# EAGLE design 8RelaySwitch (EAGLE 6.4)
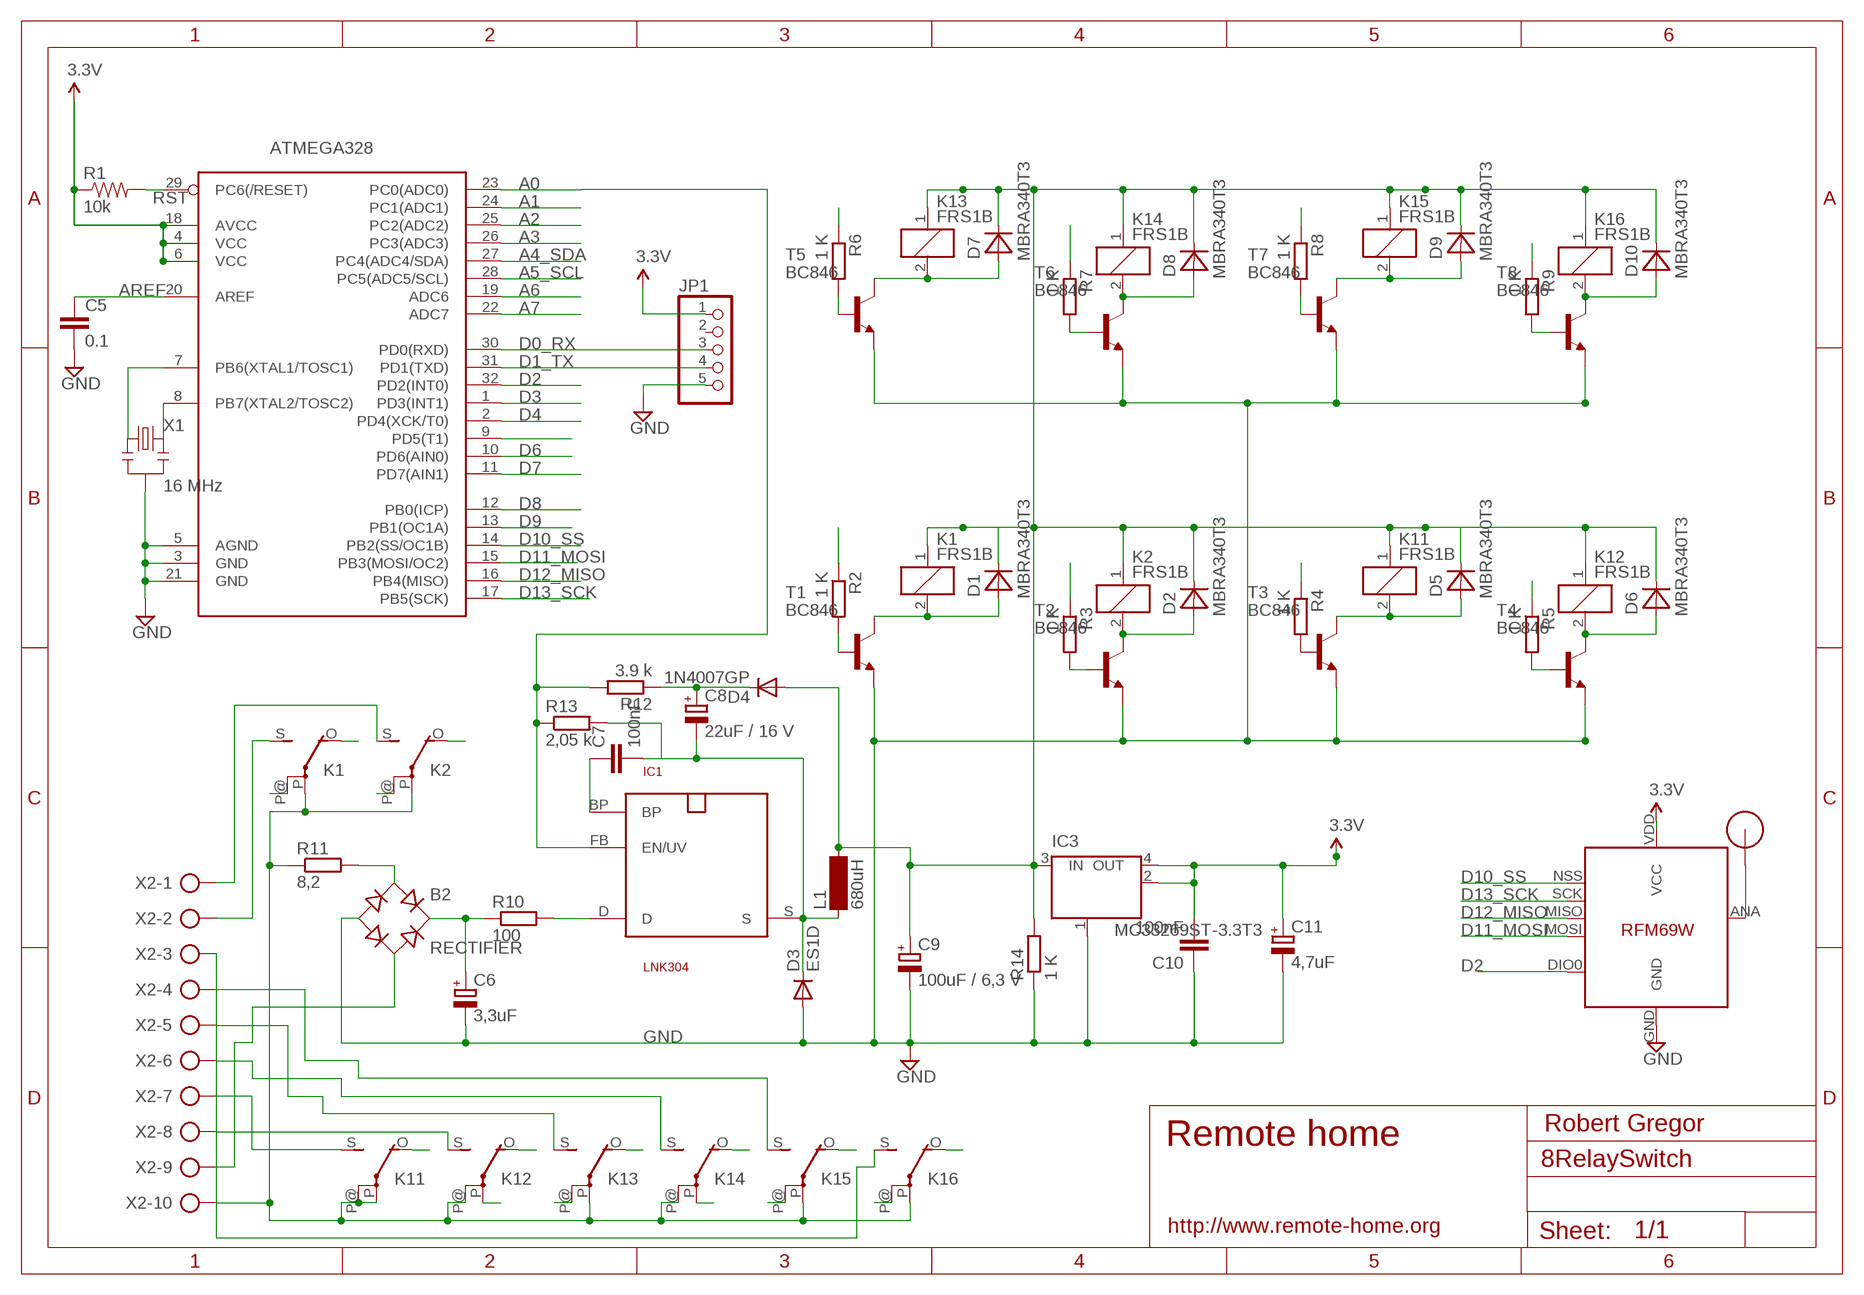
[diagram p0: schematic, sheet 1]

## Parts
ATMEGA328  ATMega-328  ATMEGA168/328TQFP32  [TQFP32-08]
B2  RECTIFIER  RECTIFIER-S40  [TO-269AA]
C5  0.1  CAP0603-CAP  [0603-CAP]
C6  3,3uF  CPOL-EUE5-10.5  [E5-10,5]
C7  100nF  C-EUC2012  [C2012]
C8  22uF / 16 V  CPOL-EUSMCC  [SMC_C]
C9  100uF / 6,3 V  CPOL-EUE2.5-5  [E2,5-5]
C10  100nF  C-EUC2012  [C2012]
C11  4,7uF  CPOL-EUSMCA  [SMC_A]
D1  MBRA340T3  [SMA]
D2  MBRA340T3  [SMA]
D3  ES1D  DIODE-DO214AC  [DO214AC]
D4  1N4007GP  DIODE-DO214AA  [DO214AA]
D5  MBRA340T3  [SMA]
D6  MBRA340T3  [SMA]
D7  MBRA340T3  [SMA]
D8  MBRA340T3  [SMA]
D9  MBRA340T3  [SMA]
D10  MBRA340T3  [SMA]
IC1  LNK304  SO-8C  [SO-8C]
IC3  MC33269ST-3.3T3  [SOT223]
JP1  PINHD-1X5  [1X05]
K1  FRS1B  [FRS1B]
K2  FRS1B  [FRS1B]
K11  FRS1B  [FRS1B]
K12  FRS1B  [FRS1B]
K13  FRS1B  [FRS1B]
K14  FRS1B  [FRS1B]
K15  FRS1B  [FRS1B]
K16  FRS1B  [FRS1B]
L1  680uH  BS11  [BS11]
R1  10k  RESISTOR0603-RES  [0603-RES]
R2  1 K  R-EU_M2012  [M2012]
R3  1 K  R-EU_M2012  [M2012]
R4  1 K  R-EU_M2012  [M2012]
R5  1 K  R-EU_M2012  [M2012]
R6  1 K  R-EU_M2012  [M2012]
R7  1 K  R-EU_M2012  [M2012]
R8  1 K  R-EU_M2012  [M2012]
R9  1 K  R-EU_M2012  [M2012]
R10  100  R-EU_R2512W  [R2512W]
R11  8,2  R-EU_0411/12  [0411/12]
R12  3.9 k  R-EU_M2012  [M2012]
R13  2,05 k  R-EU_M2012  [M2012]
R14  1 K  R-EU_M2012  [M2012]
T1  BC846  [SOT23]
T2  BC846  [SOT23]
T3  BC846  [SOT23]
T4  BC846  [SOT23]
T5  BC846  [SOT23]
T6  BC846  [SOT23]
T7  BC846  [SOT23]
T8  BC846  [SOT23]
U$1  RFM12B_ANTENNA  [RFM12B-ANTENNA]
U$5  RFM69  [RFM69W-MINPADS]
X1  16 MHz  RESONATORSMD  [RESONATOR-SMD]
X2  AK500/10  [AK500/10]

## Nets
5V1: C9.+ D1.C D2.C D4.A D5.C D6.C D7.C D8.C D9.C D10.C IC3.3(IN) K1.1 K2.1 K11.1 K12.1 K13.1 K14.1 K15.1 K16.1 L1.2 R14.2
A0: ATMEGA328.23(PC0(ADC0)) IC1.FB(EN/UV) R12.2 R13.1
A1: ATMEGA328.24(PC1(ADC1)) R6.1
A2: ATMEGA328.25(PC2(ADC2))
A3: ATMEGA328.26(PC3(ADC3))
A4_SDA: ATMEGA328.27(PC4(ADC4/SDA))
A5_SCL: ATMEGA328.28(PC5(ADC5/SCL))
A6: ATMEGA328.19(ADC6)
A7: ATMEGA328.22(ADC7)
AREF: ATMEGA328.20(AREF) C5.1
D0_RX: ATMEGA328.30(PD0(RXD)) JP1.3
D1_TX: ATMEGA328.31(PD1(TXD)) JP1.4
D2: ATMEGA328.32(PD2(INT0)) U$5.DIO0
D3: ATMEGA328.1(PD3(INT1)) R7.1
D4: ATMEGA328.2(PD4(XCK/T0)) R8.1
D5: ATMEGA328.9(PD5(T1)) R2.1
D6: ATMEGA328.10(PD6(AIN0)) R3.1
D7: ATMEGA328.11(PD7(AIN1)) R4.1
D8: ATMEGA328.12(PB0(ICP)) R5.1
D9: ATMEGA328.13(PB1(OC1A)) R9.1
D10_SS: ATMEGA328.14(PB2(SS/OC1B)) U$5.NSS(SEL)
D11_MOSI: ATMEGA328.15(PB3(MOSI/OC2)) U$5.MOSI
D12_MISO: ATMEGA328.16(PB4(MISO)) U$5.MISO
D13_SCK: ATMEGA328.17(PB5(SCK)) U$5.SCK
GND [power]: ATMEGA328.3(GND) ATMEGA328.5(AGND) ATMEGA328.21(GND) B2.- C5.2 C6.- C9.- C10.1 C11.- D3.A IC3.1(GND/ADJ) JP1.5 R14.1 T1.2(E) T2.2(E) T3.2(E) T4.2(E) T5.2(E) T6.2(E) T7.2(E) T8.2(E) U$5.GND X1.2
N$1: ATMEGA328.7(PB6(XTAL1/TOSC1)) X1.1
N$2: R2.2 T1.1(B)
N$3: U$1.P$1 U$5.ANA(ANT)
N$4: D2.A K2.2 T2.3(C)
N$5: D1.A K1.2 T1.3(C)
N$6: R3.2 T2.1(B)
N$7 [220V]: K1.S(2:S) X2.2
N$8 [220V]: K12.P(2:P)
N$9 [220V]: B2.AC2 X2.9
N$10: C7.2 C8.- D3.C IC1.S L1.1 R13.2
N$11 [220V]: K1.P@(2:P)
N$13 [220V]: IC1.D R10.2
N$14 [220V]: B2.+ C6.+ R10.1
N$15 [220V]: B2.AC1 R11.2
N$16 [220V]: K2.P@(2:P)
N$17 [220V]: K1.O(2:O)
N$18: C7.1 IC1.BP
N$19 [220V]: K2.O(2:O)
N$20: C8.+ D4.C R12.1
N$21: ATMEGA328.8(PB7(XTAL2/TOSC2)) X1.3
N$22: D5.A K11.2 T3.3(C)
N$24: R4.2 T3.1(B)
N$25: D6.A K12.2 T4.3(C)
N$26: R5.2 T4.1(B)
N$27: D7.A K13.2 T5.3(C)
N$28: R6.2 T5.1(B)
N$29: D8.A K14.2 T6.3(C)
N$30: R7.2 T6.1(B)
N$31: D9.A K15.2 T7.3(C)
N$32: R8.2 T7.1(B)
N$33: D10.A K16.2 T8.3(C)
N$34: R9.2 T8.1(B)
N$35 [220V]: K14.P(2:P)
N$36 [220V]: K12.S(2:S) X2.8
N$37 [220V]: K11.S(2:S) X2.7
N$38 [220V]: K13.P@(2:P)
N$39 [220V]: K1.P(2:P) K2.P(2:P) K11.P(2:P) K11.P@(2:P) K12.P@(2:P) K13.P(2:P) K14.P@(2:P) K15.P(2:P) K16.P(2:P) R11.1 X2.10
N$40 [220V]: K15.P@(2:P)
N$41 [220V]: K16.P@(2:P)
N$42 [220V]: K11.O(2:O)
N$43 [220V]: K12.O(2:O)
N$44 [220V]: K13.O(2:O)
N$45 [220V]: K14.O(2:O)
N$46 [220V]: K15.O(2:O)
N$47 [220V]: K16.S(2:S) X2.3
N$48 [220V]: K2.S(2:S) X2.1
N$50 [220V]: K13.S(2:S) X2.5
N$51 [220V]: K14.S(2:S) X2.6
N$52 [220V]: K15.S(2:S) X2.4
N$53 [220V]: K16.O(2:O)
RST: ATMEGA328.29(PC6(/RESET)) R1.2
VCC: ATMEGA328.4(VCC) ATMEGA328.6(VCC) ATMEGA328.18(AVCC) C10.2 C11.+ IC3.2(OUT) IC3.4(OUT) JP1.1 R1.1 U$5.VDD(VCC) ; supply symbol labelled 3.3V
Unconnected: JP1.2

## Notes on the sheet
- Robert Gregor
- Remote home
- http://www.remote-home.org

## Library data of the parts
ATMEGA328 = LowPowerLab:ATMEGA168/328: Atmel 32-pin 8-bit micro, 16k flash.
B2 = rectifier:RECTIFIER-: Rectifier
C5 = LowPowerLab:CAP: Capacitor Standard 0603 ceramic capacitor, and 0.1" leaded capacitor.
C6 C8 C9 C11 = resistor:CPOL-EU: POLARIZED CAPACITOR, European symbol
C7 C10 = resistor:C-EU: CAPACITOR, European symbol
D1 D2 D5-D10 = diode:MBRA340T3: Surface Mount Schottky Power Rectifier Source: http://www.onsemi.com/pub_link/Collateral/MBRA340T3-D.PDF
D3 D4 = diode:DIODE-: DIODE
IC1 = powerint:SO-8C: 700V MOSFET für Schaltnetz-Trafos. Pin 3 fehlt. SMD
IC3 = linear:MC33269ST*: Adjustable Output Low Dropout Voltage Regulator 800 mA Source: http://www.onsemi.com/pub/Collateral/MC33269-D.PDF
JP1 = pinhead:PINHD-1X5: PIN HEADER
K1 K2 K11-K16 = relay:FRS1B: RELAY 1 x switch, same as V23101-D6-A201, Siemens; OC_FARNELL: unknown; OC_NEWARK: unknown
L1 = inductor-neosid:BS: INDUCTOR nominal inductance, magnetically screened; OC_FARNELL: unknown; OC_NEWARK: unknown
R1 = LowPowerLab:RESISTOR: Resistor Basic schematic elements and footprints for 0603, 1206, and PTH resistors.
R2-R14 = resistor:R-EU_: RESISTOR, European symbol
T1-T8 = transistor:BC846: NPN TRANSISTOR
U$1 = LowPowerLab:RFM12B_ANTENNA
U$5 = LowPowerLab:RFM69
X1 = SparkFun:RESONATOR: Resonator Small SMD resonator. This is the itty bitty 10/20MHz resonators with built in caps. CSTCE10M0G55 and CSTCE20M0V53. Footprint has been reviewed closely but hasn't been tested yet.
X2 = con-ptr500:AK500/10: CONNECTOR; OC_FARNELL: unknown; OC_NEWARK: unknown

## Net classes
1 power: width 0.381 mm, clearance 0.254 mm
2 220V: width 0.381 mm, clearance 0.508 mm

## Board
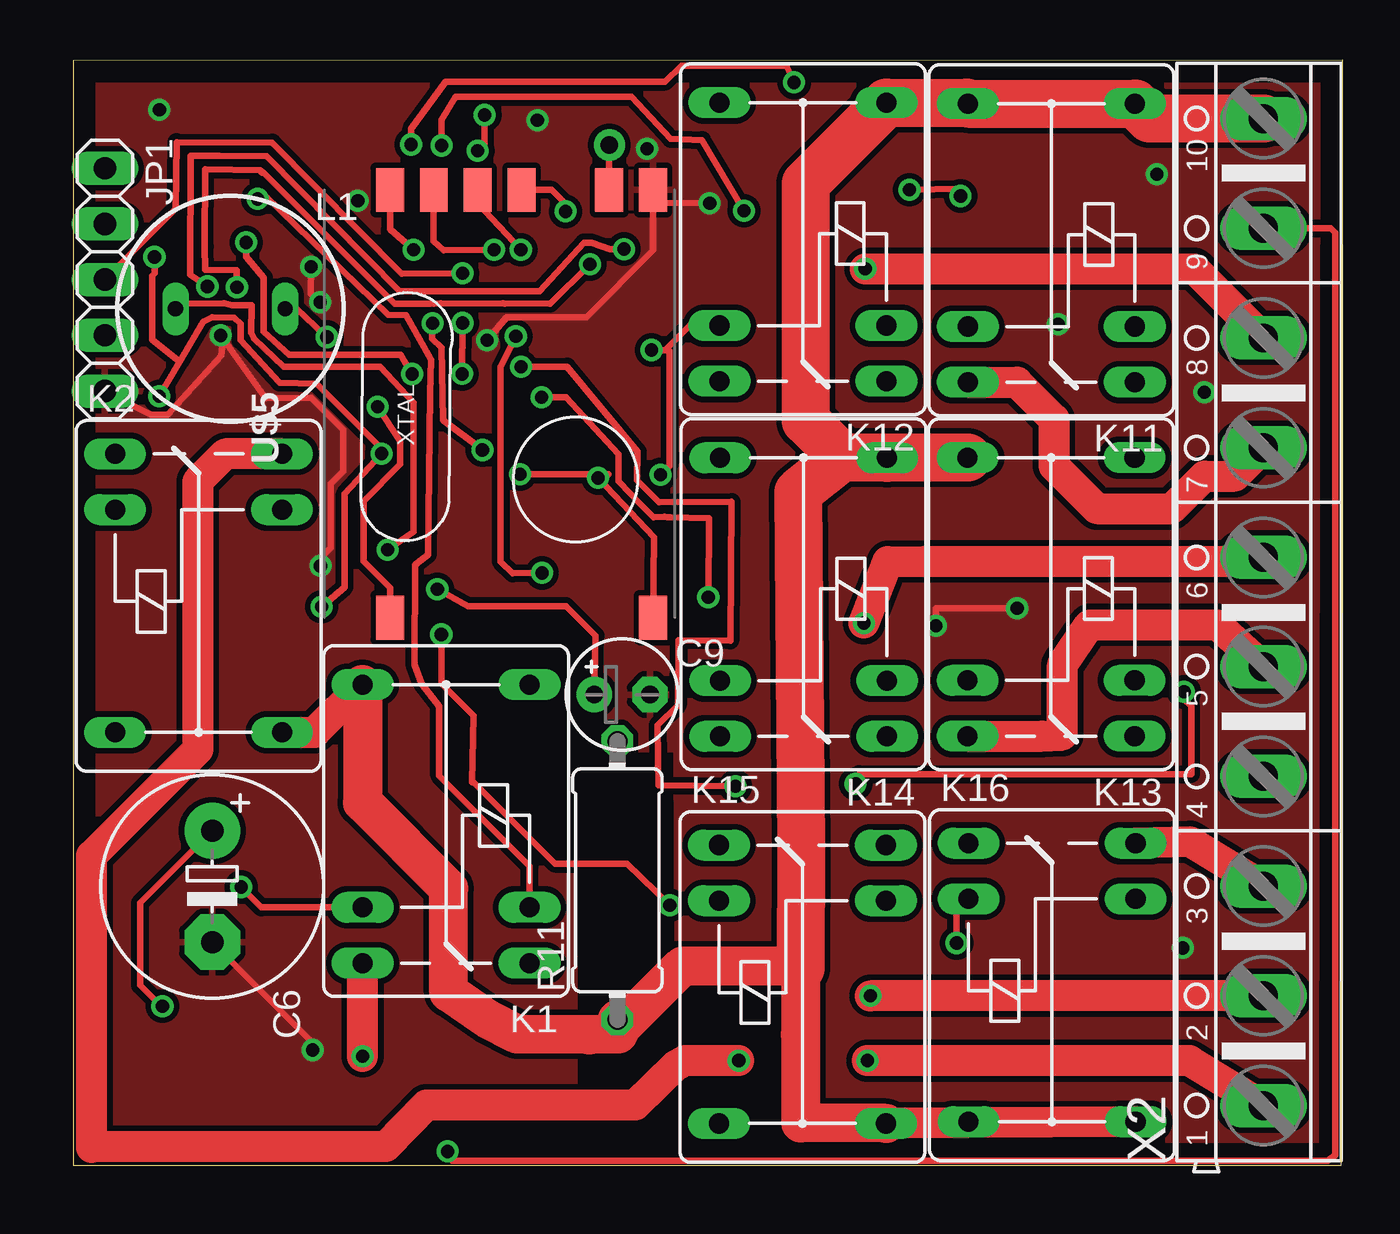
[diagram p1: board, top side]
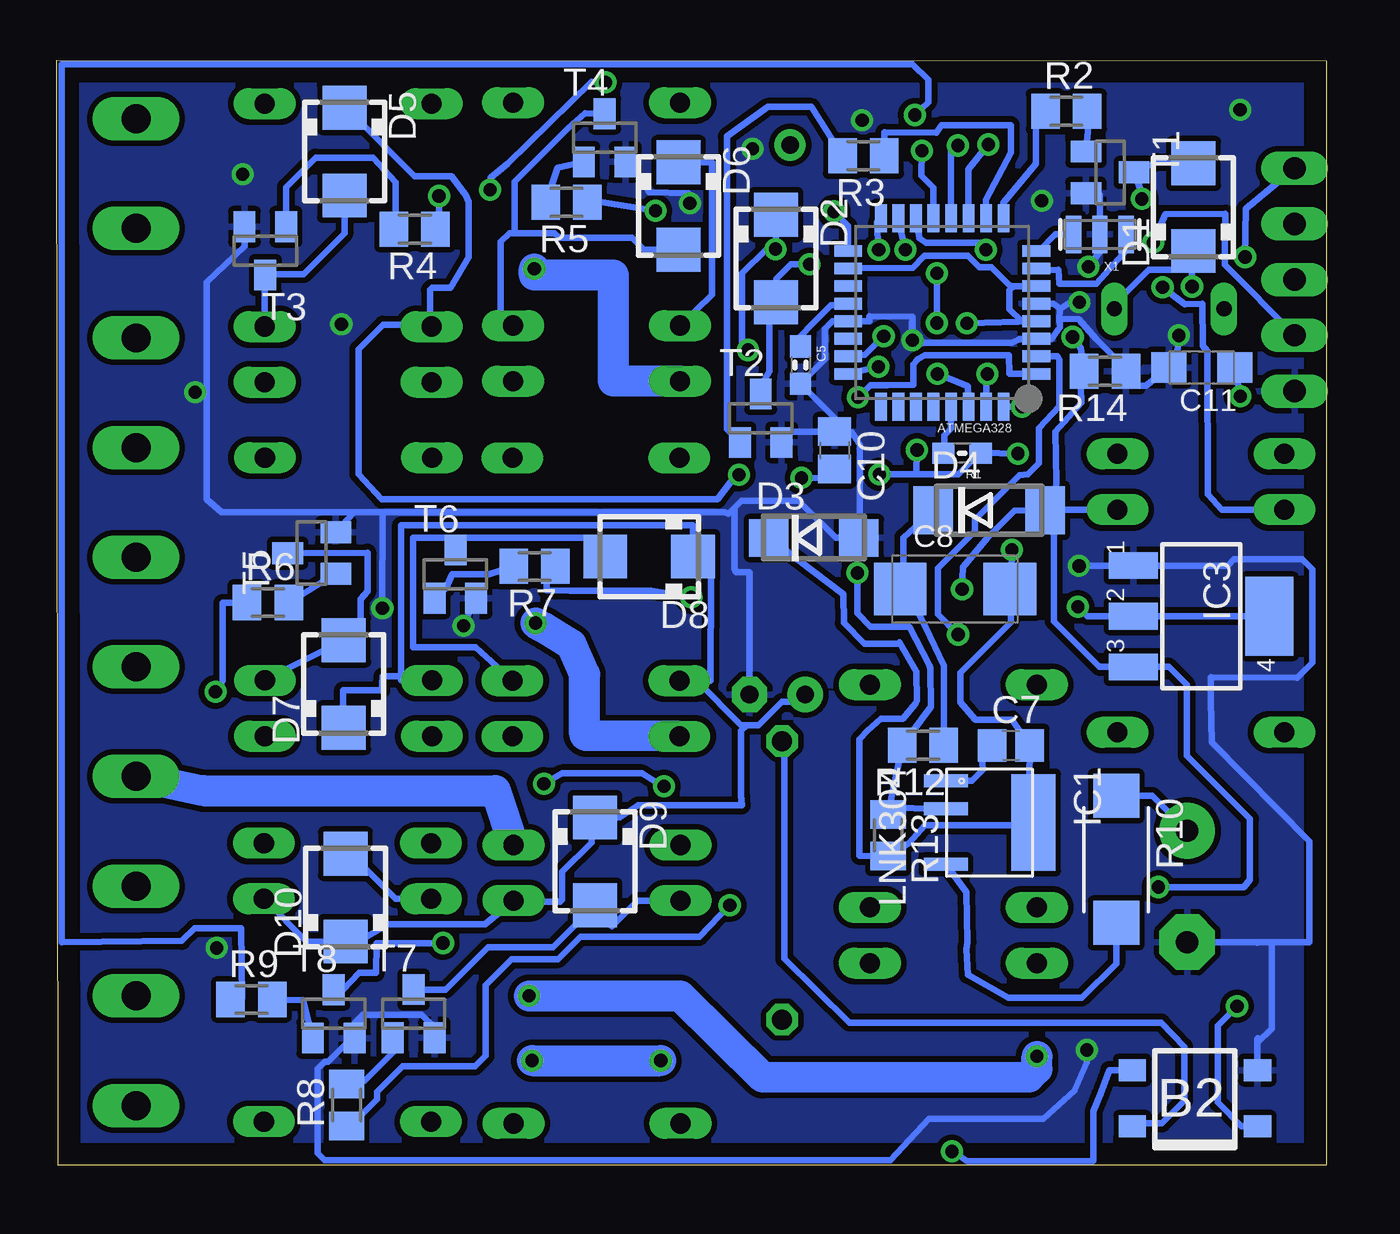
[diagram p2: board, bottom side, seen from below]

Size 57.9 x 50.38 mm. Coordinates in mm from the lower left corner, seen from the top.
Outline: 0,0 57.85,0 57.9,50.38 0,50.35 0,0
Copper layers (1*16): Top 0.035mm / dielectric 1.5mm / Bottom 0.035mm
Design rules "default": minimum track width 10mil, minimum drill 24mil, track to track 8mil, track to pad 8mil, pad to pad 8mil, via to via 8mil, smd to smd 8mil, copper to edge 40mil, drill to drill 8mil, minimum pad ring 10mil, minimum via ring 8mil, stop-mask expansion 4mil, vias tented up to drill 0mil, thermal gap 10mil

### Footprints (pad centres in the part's own frame; a part is rotated, then mirrored left to right if it is on the bottom)
TQFP32-08 = smd 1.27 x 0.533: 1 -4.293,2.8; 2 -4.293,2; 3 -4.293,1.2; 4 -4.293,0.4; 5 -4.293,-0.4; 6 -4.293,-1.2; 7 -4.293,-2; 8 -4.293,-2.8; 17 4.293,-2.8; 18 4.293,-2; 19 4.293,-1.2; 20 4.293,-0.4; 21 4.293,0.4; 22 4.293,1.2; 23 4.293,2; 24 4.293,2.8 | smd 0.533 x 1.27: 9 -2.8,-4.293; 10 -2,-4.293; 11 -1.2,-4.293; 12 -0.4,-4.293; 13 0.4,-4.293; 14 1.2,-4.293; 15 2,-4.293; 16 2.8,-4.293; 25 2.8,4.293; 26 2,4.293; 27 1.2,4.293; 28 0.4,4.293; 29 -0.4,4.293; 30 -1.2,4.293; 31 -2,4.293; 32 -2.8,4.293
TO-269AA = smd 1 x 1.25: + -1.28,-2.855; - 1.28,-2.855; AC1 -1.28,2.855; AC2 1.28,2.855
0603-CAP = smd 1.016 x 0.965: 1 -0.85,0; 2 0.85,0
E5-10,5 = drill 1.016 pad 2.54: + -2.54,0 | drill 1.016 pad 2.54 octagon: - 2.54,0
C2012 = smd 1.3 x 1.5: 1 -0.85,0; 2 0.85,0
SMC_C = smd 2.4 x 2.4: + -2.5,0; - 2.5,0
E2,5-5 = drill 0.813 pad 1.6: + -1.27,0 | drill 0.813 pad 1.6 octagon: - 1.27,0
SMC_A = smd 1.6 x 1.4: + -1.5,0; - 1.5,0
SMA = smd 2 x 2: A 2,0; C -2,0
DO214AC = smd 1.8 x 1.7: A 2.05,0; C -2.05,0
DO214AA = smd 1.8 x 2.2: A 2.55,0; C -2.55,0
SO-8C = smd 0.6 x 2: BP -1.905,-2; D 1.905,-2; FB -0.635,-2 | smd 4.41 x 2: S 0,2
SOT223 = smd 1.219 x 2.235: 1 -2.311,-3.099; 2 0,-3.099; 3 2.311,-3.099 | smd 3.6 x 2.2: 4 0,3.099
1X05 = drill 1.016 long: 1 -5.08,0; 2 -2.54,0; 3 0,0; 4 2.54,0; 5 5.08,0
FRS1B = drill 0.914 long: 1 0,3.81; 2 0,-3.81; O -2.54,-3.81; P 10.16,3.81; P@ 10.16,-3.81; S -2.54,3.81
BS11 = drill 0.7 long: 1 -2.5,0; 2 2.5,0
0603-RES = smd 1.016 x 0.965: 1 -0.85,0; 2 0.85,0
M2012 = smd 1.3 x 1.6: 1 -0.95,0; 2 0.95,0
R2512W = smd 2 x 2.1: 1 -2.896,0; 2 2.896,0
0411/12 = drill 0.914 octagon: 1 -6.35,0; 2 6.35,0
SOT23 = smd 1 x 1.4: 1 -0.95,-1.1; 2 0.95,-1.1; 3 0,1.1
RFM12B-ANTENNA = drill 0.8 pad 1.422: P$1 0,0
RFM69W-MINPADS = smd 2 x 1.27: ANA 8,-5; DIO0 -11.5,5; GND 8,-7; MISO 8,1; MOSI 8,3; NSS 8,5; SCK 8,-1; VDD -11.5,-7
RESONATOR-SMD = smd 0.7 x 1.7: 1 -1.2,0; 2 0,0; 3 1.2,0
AK500/10 = drill 1.321 long: 1 -22.504,0; 2 -17.501,0; 3 -12.497,0; 4 -7.493,0; 5 -2.489,0; 6 2.489,0; 7 7.493,0; 8 12.497,0; 9 17.501,0; 10 22.504,0

### Placement (x,y rotation side)
ATMEGA328  17.52,38.88 180 bottom
B2  5.99,3.05 90 bottom
C5  23.99,36.48 270 bottom
C6  6.34,12.7 270 top
C7  14.38,19.13 0 bottom
C8  16.93,26.27 0 bottom
C9  25.04,21.46 0 top
C10  22.43,32.6 270 bottom
C11  5.68,36.37 180 bottom
D1  6.06,43.68 90 bottom
D2  25.1,41.34 270 bottom
D3  23.37,28.6 0 bottom
D4  15.38,29.86 0 bottom
D5  44.79,46.22 270 bottom
D6  29.55,43.73 270 bottom
D7  44.82,21.94 90 bottom
D8  30.89,27.75 180 bottom
D9  33.35,13.85 270 bottom
D10  44.74,12.19 90 bottom
IC1  15.35,15.62 270 bottom
IC3  5.69,25.03 270 bottom
JP1  1.44,40.38 270 top
K1  17.01,11.75 90 top
K2  5.71,29.89 270 top
K11  44.62,38.24 90 top
K12  33.29,38.28 90 top
K13  44.61,22.1 90 top
K14  33.32,22.09 90 top
K15  33.27,12.05 270 top
K16  44.65,12.14 270 top
L1  7.17,39.05 0 top
R1  16.61,32.47 180 bottom
R2  11.85,48.05 0 bottom
R3  21.12,46.02 180 bottom
R4  41.58,42.68 180 bottom
R5  34.65,43.91 180 bottom
R6  48.28,25.65 0 bottom
R7  36.11,27.3 180 bottom
R8  44.69,2.74 90 bottom
R9  49.03,7.55 0 bottom
R10  9.58,13.94 270 bottom
R11  24.82,12.98 90 top
R12  18.39,19.14 180 bottom
R13  19.98,15.03 270 bottom
R14  10.08,36.2 180 bottom
T1  9.86,45.27 270 bottom
T2  25.8,34.05 0 bottom
T3  48.4,41.69 180 bottom
T4  32.92,46.84 0 bottom
T5  46.28,27.9 90 bottom
T6  39.73,26.94 0 bottom
T7  41.63,6.9 0 bottom
T8  45.28,6.89 0 bottom
U$1  24.46,46.52 0 top
U$5  19.45,36.46 90 top
X1  10.33,42.44 180 bottom
X2  54.29,25.22 90 top

### Tracks (layer width: path | path; a pad name or v marks a point on that pad's centre or on a via)
5V1  (via drill 0.6)
  Top 0.305: v7.67,12.68 8.57,11.75 K1.1 | v11.57,37.76 11.44,37.85 10.19,39.05 L1.2 | C9.+ 23.83,24.13 22.47,25.49 18.02,25.49 v16.61,26.26 | v25.13,41.77 24.48,41.77 23.64,42.06 23.3,42.06 21.27,39.84 14.88,39.84 8.82,45.99 6.65,46.02 5.36,46.03 5.34,40.61 v6.12,40.06 | K12.1 28.1,38.28 26.98,37.17 v26.39,37.17 27.17,37.17 27.2,37.14 27.2,31.88 27.18,31.86 26.83,31.53 v26.8,31.49
  Bottom 0.305: D4.A 12.43,28.74 12.43,24.8 10.34,22.72 IC3.3 7.19,22.73 6.37,21.9 6.37,18.67 3.48,15.79 3.48,13.01 3.77,12.68 v7.67,12.68 | 12.9,29.89 D4.A | v7.67,12.68 7.68,12.66 v7.67,12.68 | v11.57,37.76 11.19,37.24 R14.2 11.21,36.2 11.17,34.77 12.35,33.45 12.3,31.16 12.39,29.88 D4.A | v16.61,26.26 16.58,27.27 15.43,28.64 15.03,29.03 14.24,29.83 D4.A | v6.12,40.06 6.12,40.87 | L1.2 9.67,39.25 8.1,40.82 6.17,40.82 6.12,40.87 | v26.39,37.17 26.65,37.5 26.65,40.66 25.54,41.77 v25.13,41.77 25.1,41.8 D2.C | D6.C 28.02,45.72 28.02,43.31 28.02,39.7 K12.1 | D5.C 44.68,48.17 41.6,45.09 39.91,45.09 39.24,44.2 39.13,43.92 39.13,42.47 39.13,41.4 39.94,40 40.79,40 40.88,39.91 40.88,38.31 K11.1 40.89,38.32 43.03,38.32 44.14,37.2 44.14,31.51 43.1,30.35 33.1,30.36 33.1,30.35 27.77,30.35 26.87,31.53 v26.8,31.49 | D1.C 6.06,40.93 6.12,40.87 | K2.1 12.79,29.89 D4.A | K13.1 42.2,22.1 42.2,22.29 | 42.2,22.29 42.2,29.17 28.89,29.17 D8.C 28.89,27.72 28.06,26.9 28.09,22.09 K14.1 28.71,22.09 26.69,20.07 26.42,20.07 | D7.C 44.85,21.65 43.1,21.65 43.05,22.29 42.2,22.29 | K16.1 46.52,10.19 D10.C 44.17,10.19 42.8,10.98 38.37,10.98 K15.1 37.02,12 34.95,12 34.86,12.09 34.86,13.37 33.52,14.71 33.52,14.88 D9.C 32.23,15.85 31.4,16.4 26.66,16.4 26.69,16.84 26.69,19.8 26.42,20.07 | 26.42,20.07 25.89,20.07 24.83,21.12 24.1,21.12 C9.+
A0  (via drill 0.6)
  Top 0.305: v20.19,37.8 19.5,36.41 19.5,27.52 20.04,26.98 v21.38,27
  Bottom 0.305: IC1.FB 18.18,16.25 19.44,16.28 19.69,16.28 R13.1 20,16 R12.2 18.04,20.9 18.06,22.64 18.11,22.78 19.01,24.54 20.8,24.54 21.38,25.16 v21.38,27 | ATMEGA328.23 21.04,36.95 v20.19,37.8
A1  (via drill 0.6)
  Top 0.305: v20.42,36.4 22.52,36.41 25.74,32.54 25.71,31.24 26.71,30.21 30.03,30.24 29.98,23.91 27.61,23.94 27.58,20.98 26.66,20.06 26.68,18.53 26.7,17.33 v30.21,17.27 | v35.69,17.39 35.85,17.83 51,17.83 51,20.91 50.67,21.25 v50.67,21.58
  Bottom 0.305: ATMEGA328.24 v20.42,36.4 | v30.21,17.27 30.35,17.32 31.2,17.86 34.86,17.86 v35.69,17.39 | R6.1 50.34,25.64 50.34,22.09 50.6,21.54 v50.67,21.58
AREF
  Bottom 0.305: C5.1 24,37.33 24.01,37.34 24.01,37.78 23.41,38.38 | 23.41,38.38 | 23.41,38.38 22.58,39.21 21.88,39.21 ATMEGA328.20
D0_RX  (via drill 0.6)
  Top 0.305: v17.76,40.67 14.98,40.64 9.08,46.63 4.71,46.65 4.68,43.61 JP1.3 | v17.76,38.4 v17.74,36.08
  Bottom 0.305: v17.76,40.67 v17.76,38.4 | v17.74,36.08 16.34,35.52 ATMEGA328.30
D1_TX  (via drill 0.6)
  Top 0.305: v7.88,42.07 7.88,41.43 8.69,40.47 8.69,38 9.85,36.95 14.94,36.95 v15.46,36.07
  Bottom 0.305: v7.88,42.07 7.33,43.37 4.6,43.39 4.62,41.06 JP1.4 | v15.46,36.07 15.5,36 15.51,35.56 15.51,34.6 ATMEGA328.31
D2  (via drill 0.6)
  Top 0.305: U$5.DIO0 14.45,26.34 13.24,27.54 13.24,30.27 14.92,31.95 14.92,33 v13.88,34.58
  Bottom 0.305: v13.88,34.58 14.71,34.58 ATMEGA328.32
D3  (via drill 0.6)
  Top 0.305: v21.36,35.02 22.48,35.02 24.88,32.4 24.86,31.19 25.93,30.09 26.46,29.55 26.98,29.56 27.12,29.54 27.23,29.54 27.14,29.54 28.99,29.51 v28.97,25.89
  Bottom 0.305: ATMEGA328.1 14.45,36.08 14.47,36.93 18.3,36.93 18.65,36.74 18.65,36.72 18.84,36.52 18.84,35.57 20.02,35.55 20.8,35.55 v21.36,35.02 | v28.97,25.89 30.77,26.19 34.42,26.19 34.49,26.19 35.57,26.22 35.57,27.26 R7.1
D4  (via drill 0.6)
  Top 0.305: v16.79,24.19 16.79,21.96 18.26,20.49 18.2,17.45 18.27,17.45 21.97,13.75 25.25,13.75 v27.21,11.85
  Bottom 0.305: R8.1 44.49,1.79 43.29,3 43.29,3.35 42.14,4.5 38.83,4.5 38.35,4.99 38.35,8.2 37.15,9.4 35.04,9.4 34.02,10.41 28.59,10.41 v27.21,11.85 | ATMEGA328.2 12.27,36.88 12.16,36.72 12.16,34.6 13.11,33.59 13.11,32 13.61,31.51 14,31.45 16.02,29.43 16.02,28.91 17.71,27.22 17.71,25.11 v16.79,24.19
D5
  Bottom 0.305: R2.1 13.24,48.05 13.24,45.65 14.72,43.89 ATMEGA328.9
D6
  Bottom 0.305: ATMEGA328.10 15.52,44.02 14.39,46.16 14.39,47.42 17.55,47.42 17.55,47.41 17.79,47.08 20.16,47.09 R3.1
D7  (via drill 0.6)
  Top 0.305: v15.41,46.54 15.41,47.26 16.98,49.4 22,49.4 23.11,49.41 27,49.41 27.76,50.13 32.53,50.13 v32.88,49.37 | v38.15,44.48 40.46,44.53 v40.48,44.19
  Bottom 0.305: ATMEGA328.11 16.32,45.4 v15.41,46.54 | v32.88,49.37 33.52,49.41 37.36,45.66 38.13,45.02 v38.15,44.48 | v40.48,44.19 40.48,43.2 R4.1
D8  (via drill 0.6)
  Top 0.305: v16.8,46.49 16.81,47.68 17.43,48.71 25.47,48.71 27.25,46.79 28.68,46.74 v30.6,43.52
  Bottom 0.305: ATMEGA328.12 17.12,46.47 v16.8,46.49 | v30.6,43.52 33.18,43.93 R5.1
D9  (via drill 0.6)
  Top 0.305: v18.77,47.89 18.77,46.58 v18.45,46.25
  Bottom 0.305: R9.1 49.46,7.6 49.51,10.8 51.63,10.8 52.21,10.22 57.7,10.17 57.7,50.2 18.87,50.2 18.16,49.48 18.16,48.48 v18.77,47.89 | v18.45,46.25 18.48,45.12 17.92,44.56 ATMEGA328.13
D10_SS  (via drill 0.6)
  Top 0.305: U$5.NSS 14.45,42.66 v15.53,41.74
  Bottom 0.305: v15.53,41.74 15.71,42.07 17.07,42.05 18.25,42.05 18.55,42.27 18.7,43.16 ATMEGA328.14
D11_MOSI  (via drill 0.6)
  Top 0.305: U$5.MOSI 16.45,42.13 16.9,41.72 v19.2,41.73
  Bottom 0.305: v19.2,41.73 19.54,43.15 ATMEGA328.15
D12_MISO  (via drill 0.6)
  Top 0.305: U$5.MISO 18.45,43.85 v20.42,41.73
  Bottom 0.305: v20.42,41.73 20.49,43 ATMEGA328.16
D13_SCK  (via drill 0.6)
  Top 0.305: v22.46,43.49 22.46,43.84 21.82,44.47 U$5.SCK
  Bottom 0.305: ATMEGA328.17 21.81,42.84 v22.46,43.49
GND  (via drill 0.6)
  Top 0.305: U$5.GND 26.45,43.89 | 26.45,43.89 26.45,41.71 23.41,38.67 19.77,38.67 v18.87,37.62 | v11.28,27.32 11.28,27.67 11.75,28.14 11.75,31.06 12.32,31.63 12.32,33.53 10.85,34.99 8.77,34.97 v6.72,37.83 | v10.85,40.97 10.84,39.73 v11.27,39.35 | JP1.5 3.56,34.22 4.31,34.22 6.74,36.91 6.8,37.33 | v29.03,43.86 26.56,43.88 26.45,43.89 | v39.35,24.59 39.35,25.4 v43.06,25.4 | v10.92,5.25 10.76,5.75 C6.-
  Bottom 0.305: 3.11,10.16 0.77,10.16 0.77,14.76 5.23,19.29 5.26,21.18 5.26,22.25 1.33,22.22 0.65,22.9 0.65,27.16 1.1,27.62 4.22,27.62 4.5,27.34 IC3.1 11.26,27.34 v11.28,27.32 | 3.11,10.16 C6.- | 10.33,44.26 X1.2 10.33,41.65 v10.85,40.97 | C10.1 22.43,34.07 C5.2 22.87,36.75 22.87,38.13 22.52,38.48 ATMEGA328.21 20.84,38.48 20.84,38.71 18.88,38.69 | C10.1 24.35,33.45 | C10.1 22.39,33.41 21.63,33.41 21.26,32.85 21.26,29 D3.A 22.37,28.6 24.07,30.3 26.67,30.3 27.27,29.7 | 27.27,29.7 27.06,29.91 27,29.86 27,27.21 26.92,27.02 26.32,27.02 C9.- | 18.88,38.69 18.87,37.72 18.78,37.51 14.34,37.49 13.99,37.66 13.24,37.66 ATMEGA328.3 13.21,37.66 12.53,37.66 12.15,38.21 12.18,38.59 | ATMEGA328.5 12.45,39.28 12.12,39.06 | 12.12,39.06 12.15,38.99 12.18,38.59 | 10.49,37.66 9.29,36.46 R14.1 9.29,35.54 9.28,35.53 8.23,35.53 C11.- 6.81,36.84 v6.72,37.83 | 10.49,37.66 | 10.49,37.66 11.28,38.58 12.18,38.59 | v18.87,37.62 18.91,38.32 18.88,38.69 | v11.27,39.35 11.68,39.35 12.12,39.06 | T4.2 32.09,45.6 31.06,44.89 30.89,44.36 29.1,44.32 29.1,43.86 v29.03,43.86 | T3.2 49.35,41.9 51.07,40.26 51.07,30.36 50.4,29.77 44.35,29.77 | 44.35,29.77 43.05,29.77 | 43.05,29.77 27.45,29.77 27.27,29.7 | T6.2 v39.35,24.59 | v43.06,25.4 43.05,29.77 | T5.2 44.35,29.77 | B2.- 3.14,5.76 3.11,5.78 3.11,5.59 2.48,6.23 2.48,10.16 3.14,10.14 3.11,10.16 | T7.2 40.68,6.28 41.26,6.86 43.96,6.86 | 43.96,6.86 44.33,6.49 T8.2 | 43.96,6.86 43.97,6.86 43.97,6.27 45.52,4.71 45.7,4.71 46.02,4.39 46.02,0.53 45.7,0.21 19.89,0.21 18.14,2.11 12.9,2.11 11.49,3.38 10.92,4.68 v10.92,5.25
  other vias: 12.98,43.98 3.93,48.13 49.43,45.18 44.93,38.34 51.59,35.25 50.62,9.9 21.17,47.65 26.17,46.35
  pour Top: 27,50.17 0.15,50.23 0.2,46.62 0.2,0.22 22.88,0.2 22.83,18.91 27.44,18.97 27.51,18.97 27.6,0.19 57.68,0.19 57.73,50.13 32.49,50.19
  pour Bottom: 25.19,50.18 0.2,50.21 0.2,0.2 57.67,0.2 57.76,42.84 57.76,50.19
N$1
  Bottom 0.305: ATMEGA328.7 13.22,40.84 13.18,40.79 12.23,40.82 12.18,40.19 10.48,40.18 9.12,41.71 X1.1
N$2
  Bottom 0.305: R2.2 10.88,47.11 T1.1
N$3
  Top 0.305: U$5.ANA 24.45,46.06 U$1.P$1
N$4  (via drill 0.6)
  Top 0.305: v7.47,40.03 7.45,40.81 6.02,40.83 6,41.9 6.02,45.42 8.52,45.36 8.62,45.26 8.68,45.26 14.66,39.29 16.29,39.29 16.32,39.29 16.43,39.28 16.76,39.29 19.68,39.28 19.6,39.3 21.76,39.29 v23.57,41.08
  Bottom 0.305: T2.3 25.8,35.51 25.41,36.2 25.41,38.67 25.75,39.33 D2.A 25.09,39.35 25.09,40.41 24.42,41.08 v23.57,41.08 | K2.2 4.75,29.89 5.4,30.59 5.42,37.11 5.64,37.37 5.64,37.43 5.66,39.28 6.45,39.25 v7.47,40.03
N$5  (via drill 0.6)
  Top 0.305: K1.2 20.82,13.63 16.69,17.76 16.69,20.91 15.9,21.95 15.57,22.82 15.6,27.38 16.18,27.84 16.29,35.19 16.33,36.73 15.17,38.75 14.35,38.78 8.74,44.21 8.53,44.13 v8.42,44.06
  Bottom 0.305: v8.42,44.06 8.45,44.35 T1.3 7.73,45.73 D1.A
N$6
  Bottom 0.305: R3.2 23.48,48.26 25.47,48.26 27.34,46.91 27.34,44.28 27.34,33.54 T2.1
N$7  (via drill 0.6)
  Top 1.422: X2.2 v36.36,7.72 | v13.19,4.96 K1.S
  Bottom 1.422: v36.36,7.72 29.48,7.72 25.71,4 13.56,4.02 13.19,4.39 v13.19,4.96
N$9  (via drill 0.6)
  Top 0.305: X2.9 57.37,42.72 57.57,42.52 57.57,0.45 57.23,0.19 52.41,0.19 17.28,0.2 17.07,0.41 v17.07,0.62
  Bottom 0.305: B2.AC2 9.9,4.33 10.31,3.23 10.62,2.44 10.62,0.21 10.65,0.18 16.36,0.18 v17.07,0.62
N$10  (via drill 0.6)
  Top 0.305: L1.1 4.9,39.28 5.12,39.28 6.86,39.3 6.87,39.29 7.26,39.2 8,39.2 8.14,39.21 8.12,37.96 8.26,37.69 9.6,36.41 13.99,36.41 15.52,34.77 15.52,28.87 v14.34,28.06
  Bottom 0.305: v14.34,28.06 14.38,25.86 C8.- 14.39,24.74 16.69,22.44 16.69,21.11 16,20.32 14.33,20.32 C7.2 13.56,15.83 IC1.S 13.48,15.49 18.3,15.49 19.03,14.68 R13.2 20,14.07 21.28,14.1 21.28,19.41 20.91,19.82 20.31,20.36 19.3,20.36 18.74,21.05 18.67,21.17 18.7,22.49 19.46,23.84 19.52,23.78 21.06,23.78 22.01,24.72 22.03,26.03 D3.C
N$13
  Bottom 0.305: R10.2 9.58,9.19 11.15,7.64 14.49,7.64 16.35,8.67 16.41,9.84 16.36,10.16 16.41,12.44 IC1.D
N$14  (via drill 0.6)
  Top 0.305: v4.07,7.24 4,7.24 3.05,8.2 3.05,11.95 C6.+
  Bottom 0.305: R10.1 7.93,16.83 C6.+ | B2.+ 3.87,1.77 4.96,2.86 4.96,6.35 v4.07,7.24
N$15
  Bottom 0.305: B2.AC1 8.85,1.83 8.77,1.91 7.5,1.91 6.48,2.92 6.48,5.4 7.52,6.49 21.75,6.49 24.72,9.4 24.72,19.23 R11.2
N$18
  Bottom 0.305: C7.1 15.74,19.14 15.66,18.02 16.16,17.52 IC1.BP
N$20
  Bottom 0.305: R12.1 17.44,22.77 18.29,24.55 18.93,25.85 C8.+ 19.39,25.89 19.29,25.99 19.29,28.61 D4.C
N$21
  Bottom 0.305: ATMEGA328.8 13.11,41.68 12.35,42.44 X1.3 | X1.3
N$22
  Bottom 0.305: K11.2 48.43,40.56 T3.3 48.36,40.63 46.65,40.63 44.79,42.49 D5.A
N$24
  Bottom 0.305: T3.1 47.45,44.6 46.11,45.94 43.47,45.94 42.45,44.82 42.45,43.18 R4.2
N$25
  Bottom 0.305: D6.A 31.13,41.73 31.67,42.28 34.98,42.28 35.2,42.5 36.77,42.5 | 36.77,42.5 37.26,42.5 37.66,42.1 37.66,38.85 K12.2 | T4.3 33.8,47.96 34.59,47.28 35.05,46.81 37.03,44.85 37.03,42.5 36.77,42.5
N$26
  Bottom 0.305: R5.2 35.06,45.48 T4.1
N$27
  Bottom 0.305: T5.3 43.74,27.92 43.74,26.16 44.05,25.81 44.05,23.69 D7.A K13.2
N$28
  Bottom 0.305: T5.1 R6.2
N$29
  Bottom 0.305: D8.A 33.38,27.33 33.74,27.33 33.74,28.6 40.16,28.6 | 40.16,28.6 41.65,28.6 41.65,23.61 38.8,23.61 K14.2 | T6.3 40.08,28.52 40.16,28.6
N$30
  Bottom 0.305: T6.1 41.03,25.39 40.14,26.3 | 40.14,26.3 | 40.14,26.3 39.88,26.95 38.18,26.95 R7.2
N$31
  Bottom 0.305: K15.2 31.42,12.04 32.58,10.88 D9.A 35.27,9.93 38.24,9.93 40.16,8 T7.3
N$32
  Bottom 0.305: T7.1 42.58,5.12 43.86,3.84 44.55,3.84 R8.2
N$33  (via drill 0.6)
  Top 0.305: v40.3,10.13 40.3,11.59 K16.2
  Bottom 0.305: K16.2 42.46,12.14 44.08,13.76 44.31,13.76 D10.A | v40.3,10.13 43.31,10.11 43.34,8.76 44.11,8.76 44.85,7.99 T8.3
N$34
  Bottom 0.305: R9.2 46.67,7.52 T8.1
N$36  (via drill 0.6)
  Top 1.422: v36.13,40.87 51.13,40.87 X2.8
  Bottom 1.422: K12.S 32.51,35.74 32.51,40.59 36.13,40.59 v36.13,40.87
N$37
  Top 1.422: K11.S 43.06,35.7 44.74,34.01 44.74,31.88 46.69,29.93 50.11,29.93 51.6,31.42 53,31.42 X2.7
N$39
  Top 1.422: K2.P 11.02,19.73 K1.P | K16.P K15.P | 24.86,5.97 24.86,6.14 | 33.09,9.09 33.18,9
  Top 1.778: K1.P 13.2,16.54 17.13,12.6 17.13,7.87 18.91,6.66 20.25,5.97 23.54,5.94 24.77,5.97 R11.1 24.91,6.06 24.86,5.97 | 33.18,9 33.17,5.96 33.18,1.92 K15.P | 24.86,6.14 27.8,9.09 33.09,9.09
  Top 2.184: X2.10 49.11,47.72 K11.P@ K11.P 40.77,48.44 K12.P@ 33.42,44.77 33.42,33.94 35.1,32.26 | K13.P K14.P@ | K13.P 35.1,32.26 | K13.P 35.1,32.26 | 35.1,32.26 35.08,32.29 | 35.08,32.29 | 35.08,32.29 33.07,30.68 33.2,14.47 33.18,9
N$47
  Top 1.422: X2.3 50.97,14.73 K16.S
N$48  (via drill 0.6)
  Top 1.422: K2.S 6.93,32.43 5.68,31.18 5.68,18.95 0.84,14.11 0.84,0.79 0.88,0.84 14.25,0.84 16.1,2.73 25.63,2.73 27.49,4.54 27.89,4.76 v30.36,4.76 | X2.1 50.92,4.76 v36.23,4.76
  Bottom 1.422: v36.23,4.76 v30.36,4.76
N$50
  Top 1.422: K13.S 44.19,19.56 45.12,19.61 45.12,22.83 46.34,24.6 46.37,24.64 52.2,24.64 X2.5
N$51  (via drill 0.6)
  Top 1.422: v36.07,24.71 37.16,27.52 38.91,27.54 54.12,27.54 X2.6
  Bottom 1.422: K14.S 33.78,19.59 33.83,19.63 33.83,22.38 34.44,23.73 35.69,24.5 v36.07,24.71
N$52
  Bottom 1.422: X2.4 51.23,17.07 37.9,17.07 K15.S
RST
  Bottom 0.305: ATMEGA328.29 17.12,33.57 17.42,33.27 17.42,32.51 R1.2
VCC  (via drill 0.6)
  Top 0.305: v11.32,25.45 12.37,26.36 12.38,28.65 12.38,30.6 v14.06,32.45 13.82,32.93 11.1,35.64 9.41,35.67 7.63,37.6 7.63,38.35 7.35,38.64 6.33,38.66 5.92,38.45 4.85,36.63 | U$5.VDD 26.48,28.62 v23.94,31.33 24.42,31.5 v20.38,31.5 | v16.39,38.39 16.38,37.68 16.79,37.27 16.87,33.96 v18.66,32.61 | 4.85,36.63 v3.92,35.05 | v3.7,41.41 3.7,40.67 3.59,40.56 3.59,37.64 4.85,36.63
  Bottom 0.305: IC3.4 IC3.2 10.9,25.03 v11.32,25.45 | ATMEGA328.6 14.26,40.08 | 14.26,40.08 14.45,40.12 15.27,40.94 15.83,40.94 16.34,41.46 18.3,41.46 18.32,41.44 18.34,41.44 18.85,40.93 21.79,40.9 ATMEGA328.18 | 14.26,40.08 14.45,39.89 14.45,39.03 13.89,38.48 ATMEGA328.4 v16.39,38.39 | v14.06,32.45 R1.1 15.82,32.47 16.79,31.5 18.69,31.5 | v23.94,31.33 22.86,31.32 C10.2 | 18.69,31.5 v20.38,31.5 | v18.66,32.61 18.69,31.5 | v3.92,35.05 C11.+ | JP1.1 3.68,43.61 v3.7,41.41